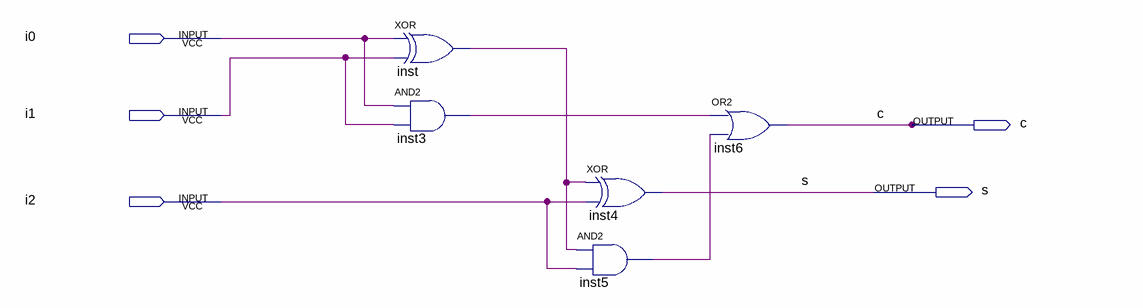
[diagram p0: schematic sheet]
// Quartus schematic fulladd.bdf as structural Verilog: 5 symbols, 5 pins
module fulladd (
  input  i0,
  input  i1,
  input  i2,
  output c,
  output s
);

  wire inst3_out, inst5_out, inst_out;

  xor inst (inst_out, i0, i1);
  and inst3 (inst3_out, i0, i1);
  xor inst4 (s, inst_out, i2);
  and inst5 (inst5_out, inst_out, i2);
  or inst6 (c, inst3_out, inst5_out);
endmodule
